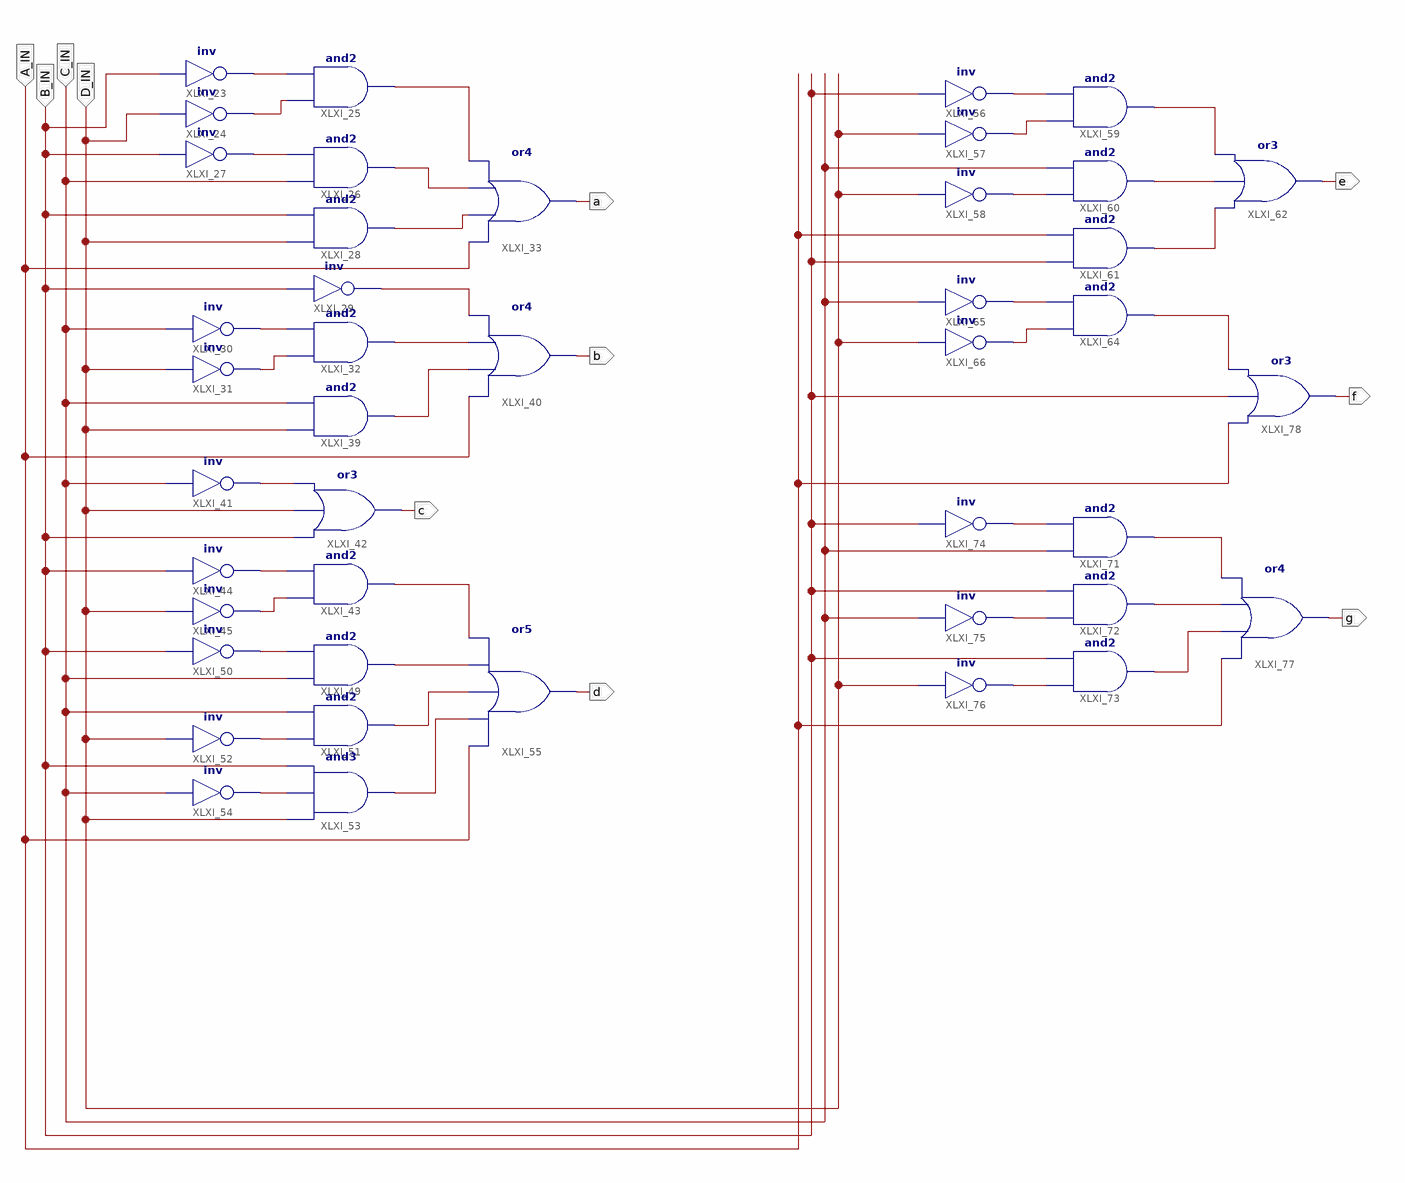
[diagram p0: schematic sheet 1]
// Xilinx ISE schematic Q1.sch (spartan6) as structural Verilog: 43 symbols, 11 ports
module Q1 (
  input  B_IN,
  input  C_IN,
  input  D_IN,
  input  A_IN,
  output a,
  output b,
  output c,
  output d,
  output e,
  output f,
  output g
);

  wire XLXN_34, XLXN_35, XLXN_36, XLXN_41, XLXN_42, XLXN_43, XLXN_44, XLXN_45, XLXN_48, XLXN_49, XLXN_50,
       XLXN_52, XLXN_57, XLXN_59, XLXN_60, XLXN_61, XLXN_62, XLXN_63, XLXN_64, XLXN_65, XLXN_66, XLXN_69,
       XLXN_70, XLXN_71, XLXN_72, XLXN_73, XLXN_74, XLXN_75, XLXN_78, XLXN_79, XLXN_84, XLXN_85, XLXN_86,
       XLXN_88, XLXN_89, XLXN_90;

  not XLXI_23 (XLXN_43, B_IN);
  not XLXI_24 (XLXN_44, D_IN);
  and XLXI_25 (XLXN_34, XLXN_44, XLXN_43);
  and XLXI_26 (XLXN_35, C_IN, XLXN_45);
  not XLXI_27 (XLXN_45, B_IN);
  and XLXI_28 (XLXN_36, D_IN, B_IN);
  not XLXI_29 (XLXN_48, B_IN);
  or XLXI_33 (a, A_IN, XLXN_36, XLXN_35, XLXN_34);
  and XLXI_32 (XLXN_49, XLXN_42, XLXN_41);
  not XLXI_30 (XLXN_41, C_IN);
  not XLXI_31 (XLXN_42, D_IN);
  and XLXI_39 (XLXN_50, D_IN, C_IN);
  or XLXI_40 (b, A_IN, XLXN_50, XLXN_49, XLXN_48);
  not XLXI_41 (XLXN_52, C_IN);
  or XLXI_42 (c, B_IN, D_IN, XLXN_52);
  and XLXI_43 (XLXN_60, XLXN_59, XLXN_57);
  not XLXI_44 (XLXN_57, B_IN);
  not XLXI_45 (XLXN_59, D_IN);
  and XLXI_49 (XLXN_61, C_IN, XLXN_64);
  not XLXI_50 (XLXN_64, B_IN);
  and XLXI_51 (XLXN_62, XLXN_65, C_IN);
  not XLXI_52 (XLXN_65, D_IN);
  and XLXI_53 (XLXN_63, D_IN, XLXN_66, B_IN);
  not XLXI_54 (XLXN_66, C_IN);
  or XLXI_55 (d, A_IN, XLXN_63, XLXN_62, XLXN_61, XLXN_60);
  not XLXI_56 (XLXN_69, B_IN);
  not XLXI_57 (XLXN_70, D_IN);
  not XLXI_58 (XLXN_71, D_IN);
  and XLXI_59 (XLXN_72, XLXN_70, XLXN_69);
  and XLXI_60 (XLXN_73, XLXN_71, C_IN);
  and XLXI_61 (XLXN_74, B_IN, A_IN);
  or XLXI_62 (e, XLXN_74, XLXN_73, XLXN_72);
  and XLXI_64 (XLXN_75, XLXN_79, XLXN_78);
  not XLXI_65 (XLXN_78, C_IN);
  not XLXI_66 (XLXN_79, D_IN);
  and XLXI_71 (XLXN_84, C_IN, XLXN_90);
  and XLXI_72 (XLXN_85, XLXN_89, B_IN);
  and XLXI_73 (XLXN_86, XLXN_88, B_IN);
  not XLXI_74 (XLXN_90, B_IN);
  not XLXI_75 (XLXN_89, C_IN);
  not XLXI_76 (XLXN_88, D_IN);
  or XLXI_77 (g, A_IN, XLXN_86, XLXN_85, XLXN_84);
  or XLXI_78 (f, A_IN, B_IN, XLXN_75);
endmodule
